# EAGLE design Bumper_coil (EAGLE 6.5.0)
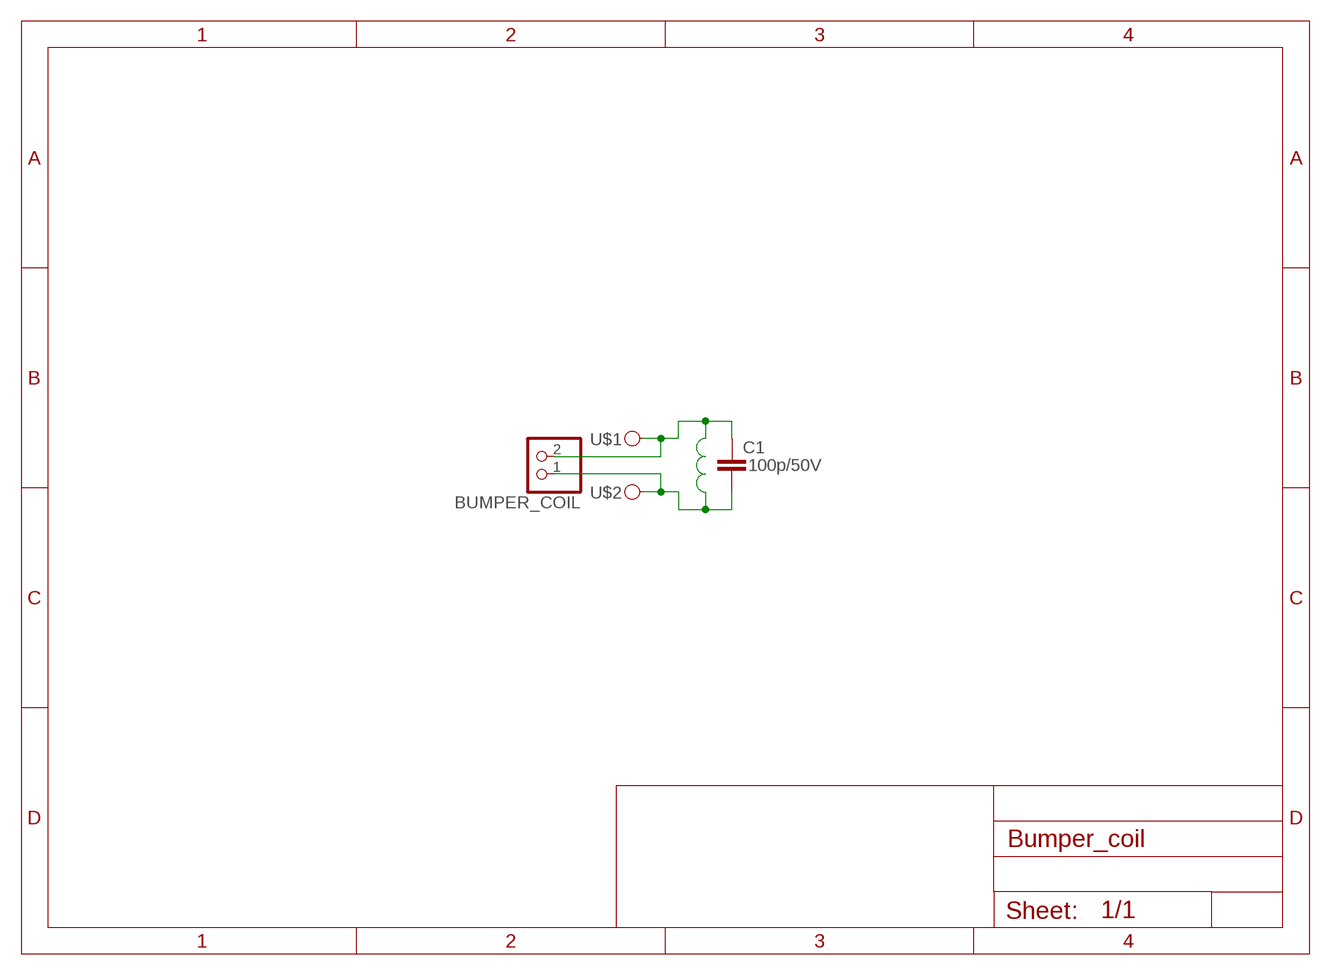
[diagram p0: schematic, sheet 1]

## Parts
BUMPER_COIL  PINHD-1X2/90  [1X02/90]
C1  100p/50V  C-EUC0402  [C0402]
U$1  PINHEAD_SMD_1X1  [PINHEAD_SMD_1X1]
U$2  PINHEAD_SMD_1X1  [PINHEAD_SMD_1X1]

## Nets
COIL0: BUMPER_COIL.1 BUMPER_COIL.2 C1.1 C1.2 U$1.1 U$2.1

## Library data of the parts
BUMPER_COIL = pinhead:PINHD-1X2: PIN HEADER
C1 = rcl_upravena:C-EU: CAPACITOR, European symbol
U$1 U$2 = PINHEAD_SMD_1X1:PINHEAD_SMD_1X1

## Board
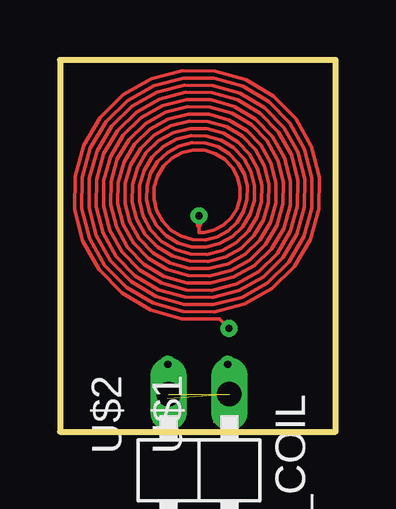
[diagram p1: board, top side]
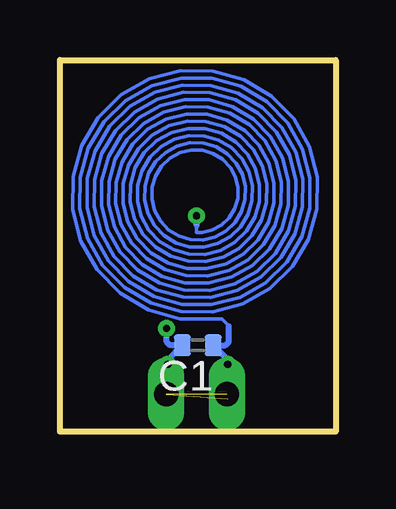
[diagram p2: board, bottom side, seen from below]

Size 11.5 x 15.5 mm. Coordinates in mm from the lower left corner, seen from the top.
Outline: 11.5,15.5 0,15.5 0,0 11.5,0 11.5,15.5
Copper layers (1*16): Top 0.018mm / dielectric 1.5mm / Bottom 0.018mm
Design rules "apama_pool_2_layers *": minimum track width 0.15mm, minimum drill 0.3mm, track to track 0.15mm, track to pad 0.2mm, pad to pad 0.2mm, via to via 0.2mm, smd to smd 0mil, copper to edge 0.2mm, drill to drill 0.3mm, minimum pad ring 0.2mm, minimum via ring 0.2mm, stop-mask expansion 0.3mm, vias tented up to drill 0.6mm, thermal gap 10mil

### Footprints (pad centres in the part's own frame; a part is rotated, then mirrored left to right if it is on the bottom)
1X02/90 = drill 1.016 long: 1 -1.27,-3.81; 2 1.27,-3.81
C0402 = smd 0.7 x 0.9: 1 -0.65,0; 2 0.65,0
PINHEAD_SMD_1X1 = smd 1.2 x 2: 1 0,-0.23

### Placement (x,y rotation side)
BUMPER_COIL  5.8,-2.25 180 top
C1  5.75,3.6 180 bottom
U$1  7.01,1.6 0 top
U$2  4.49,1.59 0 top

### Tracks (layer width: path | path; a pad name or v marks a point on that pad's centre or on a via)
COIL0  (via drill 0.3)  (2 unrouted)
  Top 0.15: 5.8,8.6 5.8,8.3 6.01,8.3 6.43,8.4 6.82,8.61 7.14,8.91 7.38,9.29 7.5,9.72 7.52,10.17 7.41,10.62 7.19,11.02 6.87,11.36 6.48,11.6 6.03,11.73 5.56,11.75 5.09,11.63 4.67,11.41 4.32,11.07 4.07,10.66 3.93,10.19 3.92,9.7 4.03,9.22 4.27,8.78 4.62,8.42 5.05,8.15 5.54,8.01 6.05,8 6.55,8.12 7,8.36 7.38,8.73 7.66,9.17 7.8,9.68 7.82,10.21 7.69,10.73 7.43,11.2 7.06,11.6 6.59,11.88 6.07,12.03 5.52,12.04 4.98,11.91 4.49,11.65 4.08,11.26 3.79,10.77 3.63,10.23 3.62,9.66 3.75,9.1 4.03,8.59 4.43,8.18 4.93,7.87 5.5,7.71 6.09,7.7 6.66,7.84 7.19,8.12 7.62,8.54 7.94,9.06 8.1,9.64 8.12,10.25 7.97,10.85 7.67,11.39 7.24,11.84 6.71,12.16 6.11,12.33 5.48,12.35 4.86,12.19 4.3,11.89 3.84,11.44 3.51,10.89 3.33,10.27 3.32,9.62 3.47,8.98 3.79,8.41 4.25,7.93 4.82,7.59 5.46,7.41 6.13,7.4 6.78,7.56 7.37,7.89 7.86,8.36 8.21,8.94 8.41,9.6 8.42,10.29 8.25,10.96 7.91,11.57 7.43,12.08 6.82,12.44 6.15,12.63 5.44,12.65 4.75,12.47 4.12,12.13 3.6,11.63 3.23,11.01 3.03,10.31 3.02,9.58 3.19,8.87 3.55,8.23 4.07,7.69 4.7,7.31 5.42,7.11 6.17,7.09 6.9,7.28 7.56,7.65 8.1,8.17 8.5,8.83 8.71,9.56 8.72,10.33 8.53,11.08 8.15,11.76 7.61,12.32 6.94,12.72 6.19,12.93 5.4,12.95 4.63,12.75 3.93,12.37 3.36,11.81 2.95,11.12 2.73,10.35 2.72,9.54 2.91,8.75 3.31,8.04 3.88,7.45 4.59,7.03 5.38,6.81 6.21,6.79 7.01,7 7.74,7.4 8.34,7.99 8.77,8.71 9,9.52 9.02,10.37 8.81,11.2 8.39,11.94 7.8,12.56 7.06,13 6.23,13.23 5.36,13.25 4.51,13.03 3.75,12.61 3.12,12 2.67,11.24 2.43,10.39 2.42,9.5 2.64,8.64 3.07,7.86 3.7,7.21 4.47,6.75 5.34,6.51 6.25,6.5 7.13,6.72 7.93,7.16 8.58,7.8 9.05,8.59 9.3,9.48 9.32,10.41 9.09,11.31 8.63,12.13 7.98,12.8 7.17,13.28 6.26,13.53 5.32,13.55 4.4,13.31 3.57,12.85 2.88,12.18 2.39,11.36 2.13,10.43 2.12,9.46 2.36,8.52 2.83,7.67 3.51,6.97 4.35,6.47 5.3,6.21 6.29,6.19 7.25,6.44 8.11,6.92 8.82,7.62 9.33,8.48 9.61,9.44 9.62,10.45 9.37,11.43 8.87,12.31 8.16,13.04 7.29,13.56 6.3,13.83 5.28,13.85 4.28,13.59 3.38,13.09 2.64,12.36 2.11,11.47 1.83,10.47 1.82,9.42 2.08,8.41 2.59,7.49 3.33,6.73 4.24,6.19 5.26,5.91 6.32,5.89 7.36,6.16 8.3,6.68 9.06,7.43 9.61,8.36 9.91,9.4 9.92,10.49 9.65,11.54 9.11,12.49 8.35,13.28 7.4,13.84 6.34,14.13 5.24,14.15 4.17,13.87 3.2,13.33 2.4,12.55 1.83,11.59 1.53,10.51 1.52,9.38 1.79,8.29 2.35,7.3 3.14,6.49 4.12,5.91 5.22,5.61 6.37,5.59 7.48,5.88 8.48,6.44 9.3,7.25 9.89,8.25 10.21,9.36 10.22,10.53 9.93,11.66 9.35,12.68 8.53,13.52 7.52,14.12 6.38,14.43 5.2,14.45 4.05,14.15 3.01,13.57 2.16,12.73 1.55,11.7 1.23,10.55 1.21,9.34 1.52,8.17 2.11,7.12 2.96,6.25 4.01,5.63 5.18,5.31 6.4,5.29 7.59,5.6 8.66,6.2 9.54,7.07 10.17,8.13 10.51,9.32 10.52,10.57 10.21,11.77 9.59,12.86 8.72,13.76 7.64,14.4 6.42,14.73 5.16,14.75 3.93,14.43 2.83,13.81 1.92,12.92 1.27,11.82 0.93,10.59 0.92,9.3 1.24,8.06 1.87,6.94 2.78,6.01 3.89,5.35 5.14,5.01 6.44,4.99 7.71,5.32 8.85,5.96 9.79,6.88 10.45,8.02 10.81,9.29 10.82,10.61 10.49,11.89 9.84,13.05 8.9,14 7.75,14.68 6.46,15.04 5.12,15.05 3.82,14.71 2.64,14.05 1.68,13.1 0.99,11.93 0.63,10.62 0.62,9.26 0.96,7.94 1.63,6.75 2.59,5.77 3.77,5.08 5.1,4.71 5.69,4.69 6.66,4.69 v7.05,4.3
  Top 0.254: v5.8,9 5.8,8.6 | U$2.1 4.5,1.38 v4.5,2.8 | v7,2.8 7.01,2.74 U$1.1
  Bottom 0.15: 5.8,8.6 5.8,8.3 5.58,8.3 5.15,8.4 4.76,8.61 4.44,8.91 4.21,9.29 4.08,9.72 4.07,10.17 4.17,10.62 4.39,11.02 4.71,11.36 5.11,11.6 5.56,11.73 6.03,11.75 6.49,11.63 6.91,11.41 7.26,11.07 7.52,10.66 7.65,10.19 7.67,9.7 7.55,9.22 7.31,8.78 6.97,8.42 6.54,8.15 6.05,8.01 5.54,8 5.04,8.12 4.58,8.36 4.2,8.73 3.93,9.17 3.78,9.68 3.77,10.21 3.89,10.73 4.15,11.2 4.53,11.6 4.99,11.88 5.52,12.03 6.07,12.04 6.61,11.91 7.1,11.65 7.5,11.26 7.8,10.77 7.95,10.23 7.97,9.66 7.83,9.1 7.55,8.59 7.15,8.18 6.65,7.87 6.09,7.71 5.5,7.7 4.92,7.84 4.4,8.12 3.96,8.54 3.65,9.06 3.48,9.64 3.47,10.25 3.61,10.85 3.91,11.39 4.34,11.84 4.88,12.16 5.48,12.33 6.11,12.35 6.72,12.19 7.28,11.89 7.74,11.44 8.07,10.89 8.25,10.27 8.27,9.62 8.11,8.98 7.79,8.41 7.34,7.93 6.77,7.59 6.13,7.41 5.46,7.4 4.8,7.56 4.21,7.89 3.72,8.36 3.37,8.94 3.18,9.6 3.17,10.29 3.33,10.96 3.67,11.57 4.16,12.08 4.76,12.44 5.44,12.63 6.15,12.65 6.84,12.47 7.46,12.13 7.98,11.63 8.36,11.01 8.55,10.31 8.57,9.58 8.39,8.87 8.03,8.23 7.52,7.69 6.88,7.31 6.17,7.11 5.42,7.09 4.69,7.28 4.03,7.65 3.48,8.17 3.09,8.83 2.88,9.56 2.87,10.33 3.05,11.08 3.43,11.76 3.97,12.32 4.64,12.72 5.4,12.93 6.19,12.95 6.96,12.75 7.65,12.37 8.22,11.81 8.63,11.12 8.86,10.35 8.87,9.54 8.67,8.75 8.27,8.04 7.7,7.45 7,7.03 6.21,6.81 5.38,6.79 4.57,7 3.84,7.4 3.24,7.99 2.81,8.71 2.58,9.52 2.57,10.37 2.78,11.2 3.19,11.94 3.79,12.56 4.53,13 5.36,13.23 6.23,13.25 7.07,13.03 7.83,12.61 8.46,12 8.91,11.24 9.16,10.39 9.17,9.5 8.95,8.64 8.51,7.86 7.89,7.21 7.11,6.75 6.25,6.51 5.34,6.5 4.46,6.72 3.66,7.16 3,7.8 2.53,8.59 2.28,9.48 2.27,10.41 2.5,11.31 2.95,12.13 3.6,12.8 4.41,13.28 5.32,13.53 6.27,13.55 7.19,13.31 8.02,12.85 8.7,12.18 9.19,11.36 9.46,10.43 9.47,9.46 9.23,8.52 8.75,7.67 8.07,6.97 7.23,6.47 6.28,6.21 5.3,6.19 4.34,6.44 3.47,6.92 2.76,7.62 2.25,8.48 1.98,9.44 1.97,10.45 2.21,11.43 2.71,12.31 3.42,13.04 4.3,13.56 5.28,13.83 6.31,13.85 7.3,13.59 8.2,13.09 8.94,12.36 9.47,11.47 9.76,10.47 9.77,9.42 9.51,8.41 8.99,7.49 8.26,6.73 7.35,6.19 6.32,5.91 5.26,5.89 4.22,6.16 3.29,6.68 2.52,7.43 1.97,8.36 1.68,9.4 1.67,10.49 1.94,11.54 2.47,12.49 3.24,13.28 4.18,13.84 5.24,14.13 6.35,14.15 7.42,13.87 8.39,13.33 9.18,12.55 9.75,11.59 10.06,10.51 10.07,9.38 9.79,8.29 9.23,7.3 8.44,6.49 7.46,5.91 6.36,5.61 5.22,5.59 4.11,5.88 3.11,6.44 2.28,7.25 1.69,8.25 1.38,9.36 1.37,10.53 1.66,11.66 2.23,12.68 3.05,13.52 4.06,14.12 5.2,14.43 6.39,14.45 7.53,14.15 8.57,13.57 9.42,12.73 10.03,11.7 10.36,10.55 10.37,9.34 10.07,8.17 9.47,7.12 8.62,6.25 7.58,5.63 6.4,5.31 5.18,5.29 3.99,5.6 2.92,6.2 2.04,7.07 1.41,8.13 1.08,9.32 1.07,10.57 1.38,11.77 1.99,12.86 2.87,13.76 3.95,14.4 5.16,14.73 6.42,14.75 7.65,14.43 8.76,13.81 9.66,12.92 10.31,11.82 10.66,10.59 10.67,9.3 10.35,8.06 9.71,6.94 8.81,6.01 7.69,5.35 6.44,5.01 5.14,4.99 3.88,5.32 2.74,5.96 1.8,6.88 1.13,8.02 0.78,9.29 0.77,10.61 1.1,11.89 1.75,13.05 2.68,14 3.83,14.68 5.12,15.04 6.46,15.05 7.77,14.71 8.94,14.05 9.91,13.1 10.59,11.93 10.96,10.62 10.97,9.26 10.63,7.94 9.96,6.75 8.99,5.77 7.81,5.08 6.48,4.71 5.79,4.69 4.74,4.69 4.45,4.4
  Bottom 0.254: 5.8,8.6 v5.8,9 | v4.5,2.8 4.5,3 C1.1 4.6,3.6 4.45,3.75 4.45,4.4 | v7,2.8 7,3 C1.2 6.9,3.6 7.05,3.75 v7.05,4.3